# Altium schematic sheet 电源及基准.SchDoc
size A4; SheetNumber: 3; SheetTotal: 12
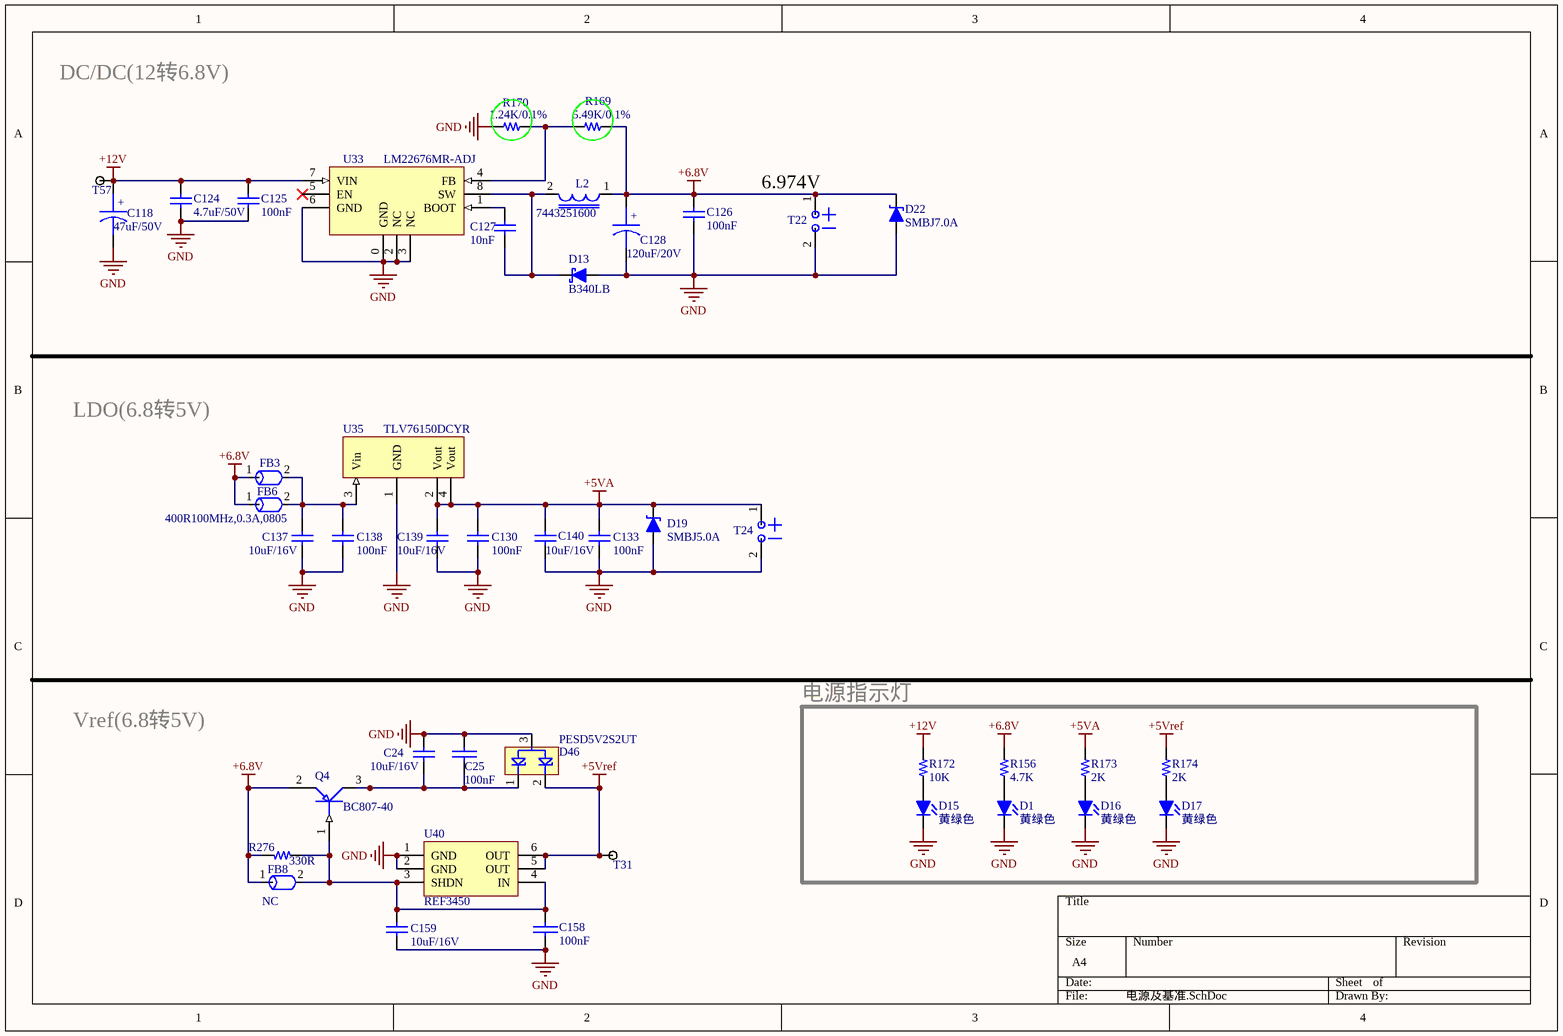
[diagram p0: 电源及基准.SchDoc]

## Parts
C24  10uF/16V  [C-0805]
C25  100nF  [C-0603]
C118  47uF/50V  [CAP-SMD-φ6.3]
C124  4.7uF/50V  [C-1210]
C125  100nF  [C-0603]
C126  100nF  [C-0603]
C127  10nF  [C-0603]
C128  120uF/20V  [CAP-SMD-φ6.3]
C130  100nF  [C-0603]
C133  100nF  [C-0603]
C137  10uF/16V  [C-0805]
C138  100nF  [C-0603]
C139  10uF/16V  [C-0805]
C140  10uF/16V  [C-0805]
C158  100nF  [C-0603]
C159  10uF/16V  [C-0805]
D1  黄绿色  [LED-0805]
D13  B340LB  [DO-214AA/SMB]
D15  黄绿色  [LED-0805]
D16  黄绿色  [LED-0805]
D17  黄绿色  [LED-0805]
D19  SMBJ5.0A  [DO-214AA/SMB]
D22  SMBJ7.0A  [DO-214AA/SMB]
D46  PESD5V2S2UT  [sot23-3]
FB3  400R100MHz,0.3A,0805  [R-0805]  (value not drawn)
FB6  400R100MHz,0.3A,0805  [R-0805]
FB8  NC  [R-0805]
L2  7443251600  [L-7050-WE-HCI]
Q4  BC807-40  [SOT23-3]
R156  4.7K  [R-0603]
R169  5.49K/0.1%  [R-0603]
R170  1.24K/0.1%  [R-0603]
R172  10K  [R-0603]
R173  2K  [R-0603]
R174  2K  [R-0603]
R276  330R  [R-0805]
T22  POWER_TEST  [BT]  (value not drawn)
T24  POWER_TEST  [BT]  (value not drawn)
T31  直插测试点  [DIPTP]  (value not drawn)
T57  直插测试点  [DIPTP]  (value not drawn)
U33  LM22676MR-ADJ  [SOIC-8(4.90*3.9)-EPAD]
U35  TLV76150DCYR  [SOT223]
U40  REF3450  [SOT23-6]

## Blocks framed on the sheet
电源指示灯: D1 D15-D17 R156 R172-R174

## Nets
+5VA: C130.2 C133.2 C139.2 C140.2 D19.K R173.2(BOT) T24.1(+) U35.2(Vout) U35.4(Vout)
+5Vref: D46.2 R174.2(BOT) T31.1 U40.5(OUT) U40.6(OUT)
+6.8V: C126.2 C128.1 D22.K FB3.1 FB6.1 FB8.1 L2.1 Q4.2(E) R156.2(BOT) R169.1(TOP) R276.2(BOT) T22.1(+)
+12V: C118.1 C124.2 C125.2 R172.2(BOT) T57.1 U33.7(VIN)
GND: C24.2 C25.2 C118.2 C124.1 C125.1 C126.1 C128.2 C130.1 C133.1 C137.1 C138.1 C139.1 C140.1 C158.1 C159.1 D1.K D13.A D15.K D16.K D17.K D19.A D22.A D46.3 R170.1(TOP) T22.2(-) T24.2(-) U33.0(GND) U33.2(NC) U33.3(NC) U33.6(GND) U35.1(GND) U40.1(GND) U40.2(GND)
NetC24_1: C24.1 C25.1 D46.1 Q4.3(C)
NetC127_1: C127.1 D13.K L2.2 U33.8(SW)
NetC127_2: C127.2 U33.1(BOOT)
NetC137_2: C137.2 C138.2 FB3.2 FB6.2 U35.3(Vin)
NetC158_2: C158.2 C159.2 FB8.2 Q4.1(B) R276.1(TOP) U40.3(SHDN) U40.4(IN)
NetD1_A: D1.A R156.1(TOP)
NetD15_A: D15.A R172.1(TOP)
NetD16_A: D16.A R173.1(TOP)
NetD17_A: D17.A R174.1(TOP)
NetR169_2: R169.2(BOT) R170.2(BOT) U33.4(FB)

Not connected (* = marked no-connect by the designer): U33 5(EN)*

## Notes on the sheet
- DC/DC(12转6.8V)
- (near T22) 6.974V
- LDO(6.8转5V)
- Vref(6.8转5V)
- (in symbol 10uF/16V贴片铝电解) +
- (in symbol 100uF/25V贴片铝电解) +

## Library data of the parts
C24 C124-C126 C130 C133 C138 C159 = 100nF_1: 贴片瓷介电容100nF±5%,0805; 物料编号: 210001894; 详细描述: X7R,50V,三星CL21B104JBCNNNC; 版本: V1.00; 制造商: 三星; 名称: 贴片瓷介电容100nF±5%,0805
C25 C158 = CAP: Capacitor
C118 = 10uF/16V贴片铝电解: EEEFT1H470AP; 版本: V1.00; 名称: 贴片铝电解电容10uF/16V; 物料编号: APLLY; 详细描述: 4.0mm X 5.3mm 体积，贴片铝电解电容10uF/16V; 制造商: TBD
C127 = 10nF_1: 贴片瓷介电容10nF±10%,0805; 物料编号: 210001895; 详细描述: X7R,50V,三星CL21B103KBANNNC; 版本: V1.00; 名称: 贴片瓷介电容10nF±10%,0805; 制造商: *
C128 = 100uF/25V贴片铝电解: 名称: 贴片铝电解电容100uF/25V; 版本: V1.00; 详细描述: 6.3mm X 7.7mm体积，贴片铝电解电容100uF/25V; 制造商: TBD; 物料编号: APPLY
C137 C139 C140 = C-1210
D1 D15-D17 = LED-0805
D13 = Diode-肖特基-214AA  (SMB): 版本: V1.00; 物料编号: APLLY; 详细描述: 贴片，二极管
D19 D22 = Diode-稳压-213AB/LL34/MiniMELF: 厂家: *; 物料名称: *; 物料编号: *; 详细描述: *
D46 = PESDxS2UT
FB3 FB6 FB8 = FB_1K/500mA_0805: Rdc0.3Ω,伍尔特,742792032; 名称: 贴片磁珠1K/500mA，0805; 版本: V1.00; 物料编号: 210001925; 详细描述: Rdc0.3,R材料,TDK MMZ2012R102A; 制造商: TDK
L2 = GPSR0750-220M
Q4 = BC807-40: 版本: V1.00; 物料编号: *; 详细描述: *
R156 R169 R172-R174 = 10K_1: 国巨RC0805FR-0710K; 版本: V1.00; 名称: 贴片电阻10K±1%; 物料编号: 210001830; 详细描述: 0805,1/8W,国巨RC0805FR-0710K; 制造商: 国巨
R170 = 3.3K_1: 国巨RC0805FR-073K3; 物料编号: 210001835; 详细描述: 0805,1/8W,国巨RC0805FR-073K3; 制造商: 国巨; 版本: V1.00; 名称: 贴片电阻3.3K±1%
R276 = 100Ω_1: 国巨RC0805FR-07100R; 物料编号: 210000765; 详细描述: 0805,1/8W,国巨RC0805FR-07100R; 制造商: 国巨; 版本: V1.00; 名称: 贴片电阻100±1%
T31 T57 = Testpiont: 版本: V1.00; 名称: 直插测试点
U33 = LM22676MR-ADJ: 版本: V1.00; 名称: 芯片LM22676MR-ADJ; 详细描述: N沟道MOS管，输出电压可调，电流3A，; 制造商: NS; 物料编号: APPLY
U35 = LM1117IMP-3.3/NOPB: 品牌：TI，型号：LM1117IMP-3.3/NOPB，800-mA Low-Dropout，SOT223，-40~+ 125°C，ROHS
U40 = REF3225